# Altium project TIDA_050024.PrjPcb (part 3 of 3)
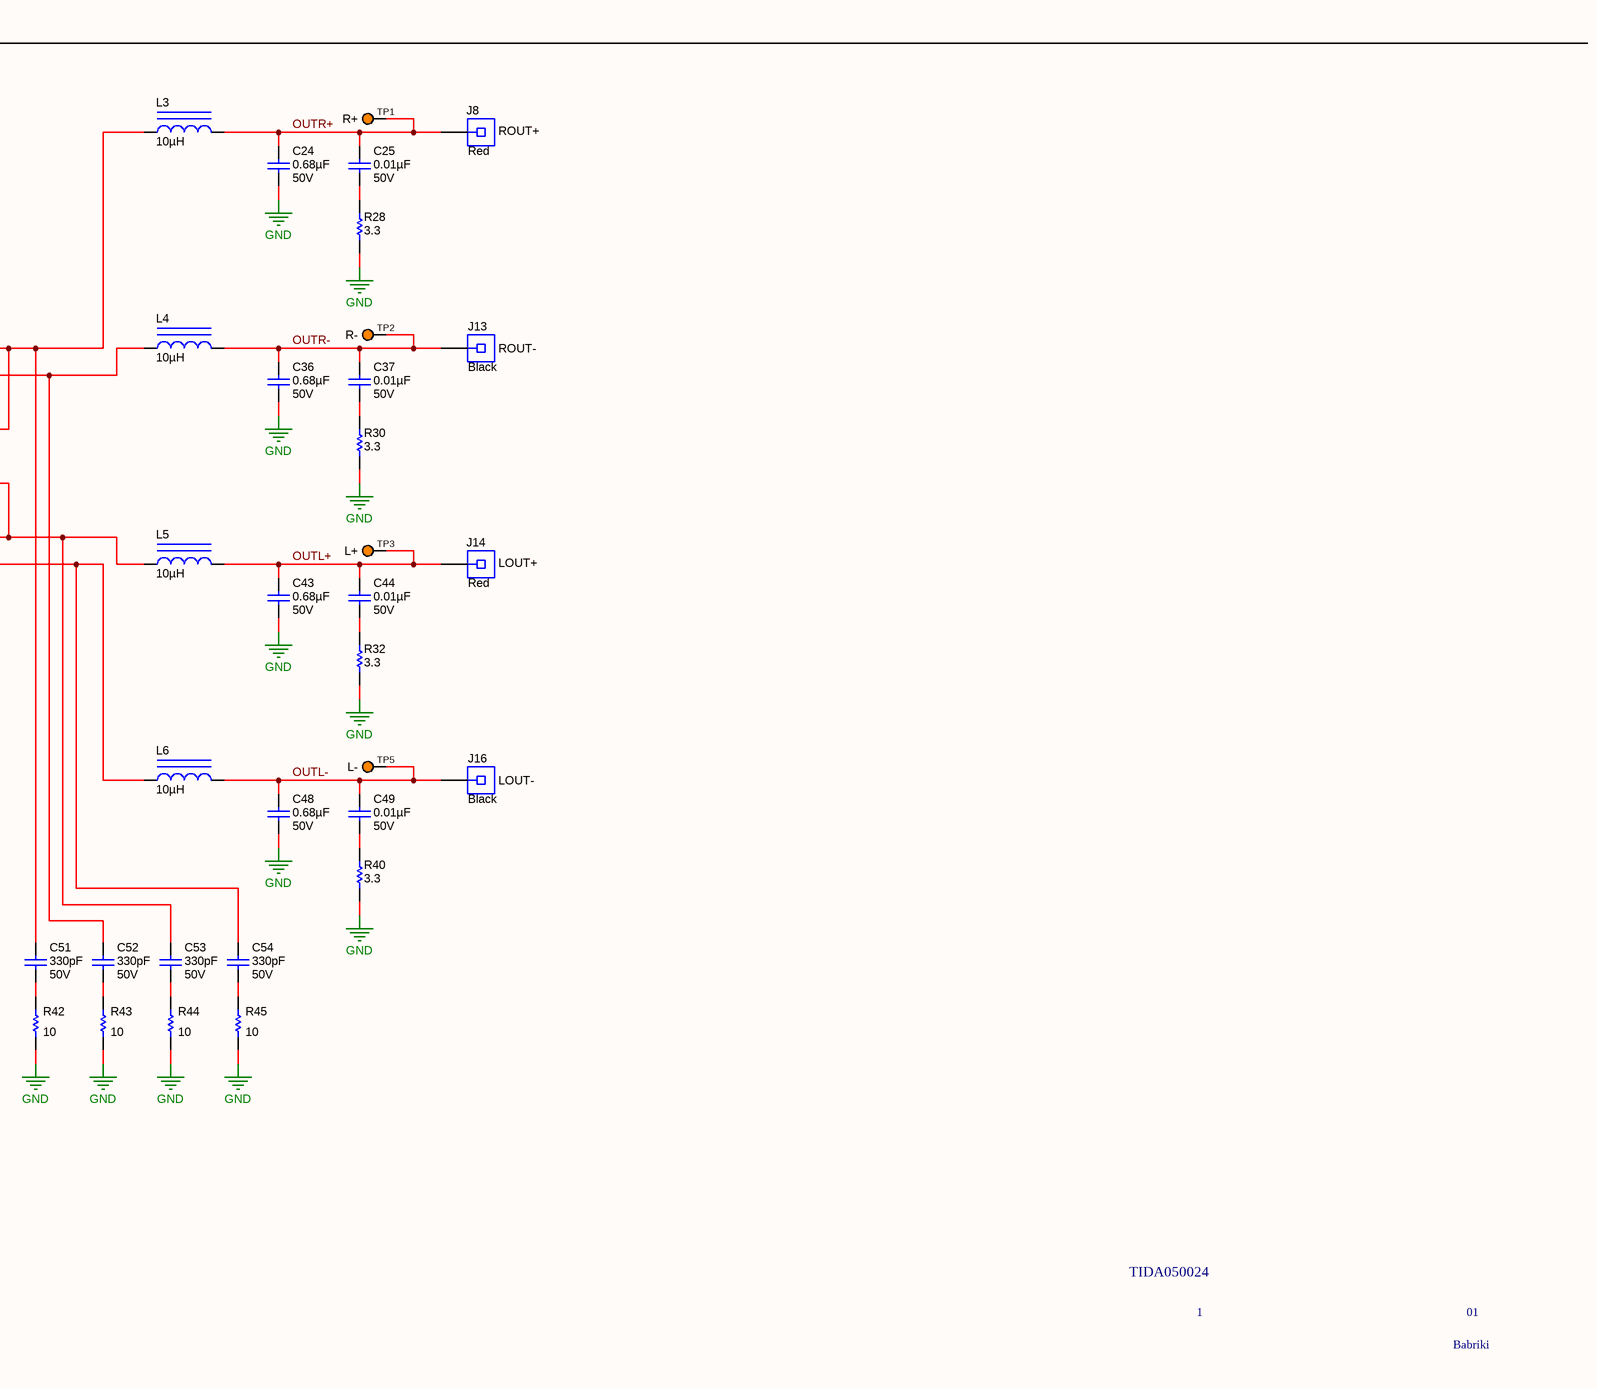
[diagram p6: TIDA050024.SchDoc, bottom right]

## Sheet TIDA050024.SchDoc (continued)

### Library data of the parts (continued)
U1 = CMP-0079087-1: 6.5-μA Quiescent Current, 1.8-A Switch Current Boost Converter, DBV0005A (SOT-23-5); Alternate PartNumber: TPS613222ADBVT; Alternate Manufacturer: Texas Instruments; SizeAreaWB_mm2: 14.82; SizeZ_mm: 1.45; SizeX_mm: 2.8; SizeY_mm: 2.9; SizeArea_mm2: 8.12; CompType: IC; AEC Qualified: N; AEC Category: Q200; ComponentLink1URL: http://www.ti.com/lit/ds/symlink/tps61322.pdf; PackageDescription: SOT-23-5; MountType: SMT; ComponentLink2URL: http://www.ti.com/product/tps61322; ComponentLink2Description: Product Folder; Manufacturer: Texas Instruments; PackageReference: DBV0005A; PartNumber: TPS613222ADBVR; ComponentLink1Description: Datasheet Link
U2 = CMP-0067158-1: Low Iq, Synchronous Boost Controller with Wide Input Voltage and 5.5V Gate Drive for Low Qg  NexFETs, RTE0016E (WQFN-16); Alternate PartNumber: TPS43061RTET; Alternate Manufacturer: Texas Instruments; Green_Lifecycle: Active; SizeAreaWB_mm2: 16.0; Green_REACh: Passed; U/M: EA; SizeZ_mm: 0.8; SizeX_mm: 3.0; SizeArea_mm2: 9.0; CompType: IC; ComponentLink1URL: http://www.ti.com/lit/ds/symlink/tps43061.pdf; Publisher: Texas Instruments; PackageDescription: WQFN-16; RoHS: Y; Footprint Path 6: C:\AltiumLibraries\Footprints\TI\.PcbLib; MountType: SMT; Green_EU RoHS-2: Passed; Manufacturer: Texas Instruments; Green_EU RoHS: Passed; PackageReference: RTE0016E; SizeY_mm: 3.0; LatestRevisionDate: 2017-06-09; PartNumber: TPS43061RTER; ComponentLink1Description: Datasheet Link
U3 = OPA4377AIPW: Low-Cost, Low Noise, 5.5 MHz CMOS Operational Amplifier, 2.2 to 5.5 V, -40 to 125 degC, 14-pin SOP (PW0014A), Green (RoHS & no Sb/Br); Manufacturer: Texas Instruments; Alternate Manufacturer: None; Alternate PartNumber: Equivalent; CMRR(Min)(dB): 70; IIB(Max)(pA): 10; Iq per channel(Max)(mA): 1.05; Number of Channels: 4; Offset Drift(Typ)(uV/C): 0.32; Slew Rate(Typ)(V/us): 2; Sub Family: Low Input Bias Current Amp (<=10pA), Low Noise Amp (<=10nV/rtHz), Low Supply Voltage Amplifier (<=2.7V), Precision Amplifier; Total Supply Voltage(Max)(+5V is 5, +/-5V is 10): 5.5; Total Supply Voltage(Min)(+5V is 5, +/-5V is 10): 2.2; Vio (25C)(Max)(mV): 1; Vn at 1kHz(Typ)(nV/rtHz): 7.5; DatasheetVersion: SBOS504B; PackageVersion: 4040064-3/G, 02/2011; PackageReference: PW0014A; PackageDescription: 14-Pin Plastic Small Outline, Body 5 x 4.4 mm, Pitch 0.65 mm; Supplier 1: Digi-Key; Supplier Part Number 1: 296-28046-5-ND; Supplier 2: Newark; Supplier Part Number 2: 21T3848; Supplier 3: Mouser; Supplier Part Number 3: 595-OPA4377AIPW; Eco-Plan: Green (RoHS & no Sb/Br); MountType: SMT; Code_JEDEC: MO-153; PartNumber: OPA4377AIPW; ComponentLink1Description: Manufacturer URL; ComponentLink1URL: http://www.ti.com/; ComponentLink2Description: Datasheet; ComponentLink2URL: http://www.ti.com/general/docs/lit/getliterature.tsp?genericPartNumber=OPA4377&fileType=pdf; ComponentLink3Description: Package Specification; ComponentLink3URL: http://www.ti.com/litv/pdf/mpds360
U4 = TPA3128D2DAPR: 2x30-W Class-D Amplifier With Low Idle Power Dissipation, DAP0032A (TSSOP-32); Manufacturer: Texas Instruments; SymbolCreator: Altium; SizeArea_mm2: 89.1; SizeAreaWB_mm2: 131.3; SizeX_mm: 8.1; SizeY_mm: 11; SizeZ_mm: 1.2; CompType: IC; U/M: EA; Green_Lifecycle: Active; Green_REACh: Passed; SymbolVersion: 2016-02-26; PartNumber: TPA3128D2DAPR; Alternate PartNumber: TPA3128D2DAP; PackageReference: DAP0032A; PackageDescription: TSSOP-32; MountType: SMT; ComponentLink1Description: Datasheet Link; ComponentLink1URL: http://www.ti.com/lit/ds/symlink/tpa3128d2.pdf; RoHS: Y; Publisher: Texas Instruments; LatestRevisionDate: 2017-05-08; Alternate Manufacturer: Texas Instruments; Green_EU RoHS: Passed; Green_EU RoHS-2: Passed